# EAGLE design WD1M_RFM9x (EAGLE 7.5.0)
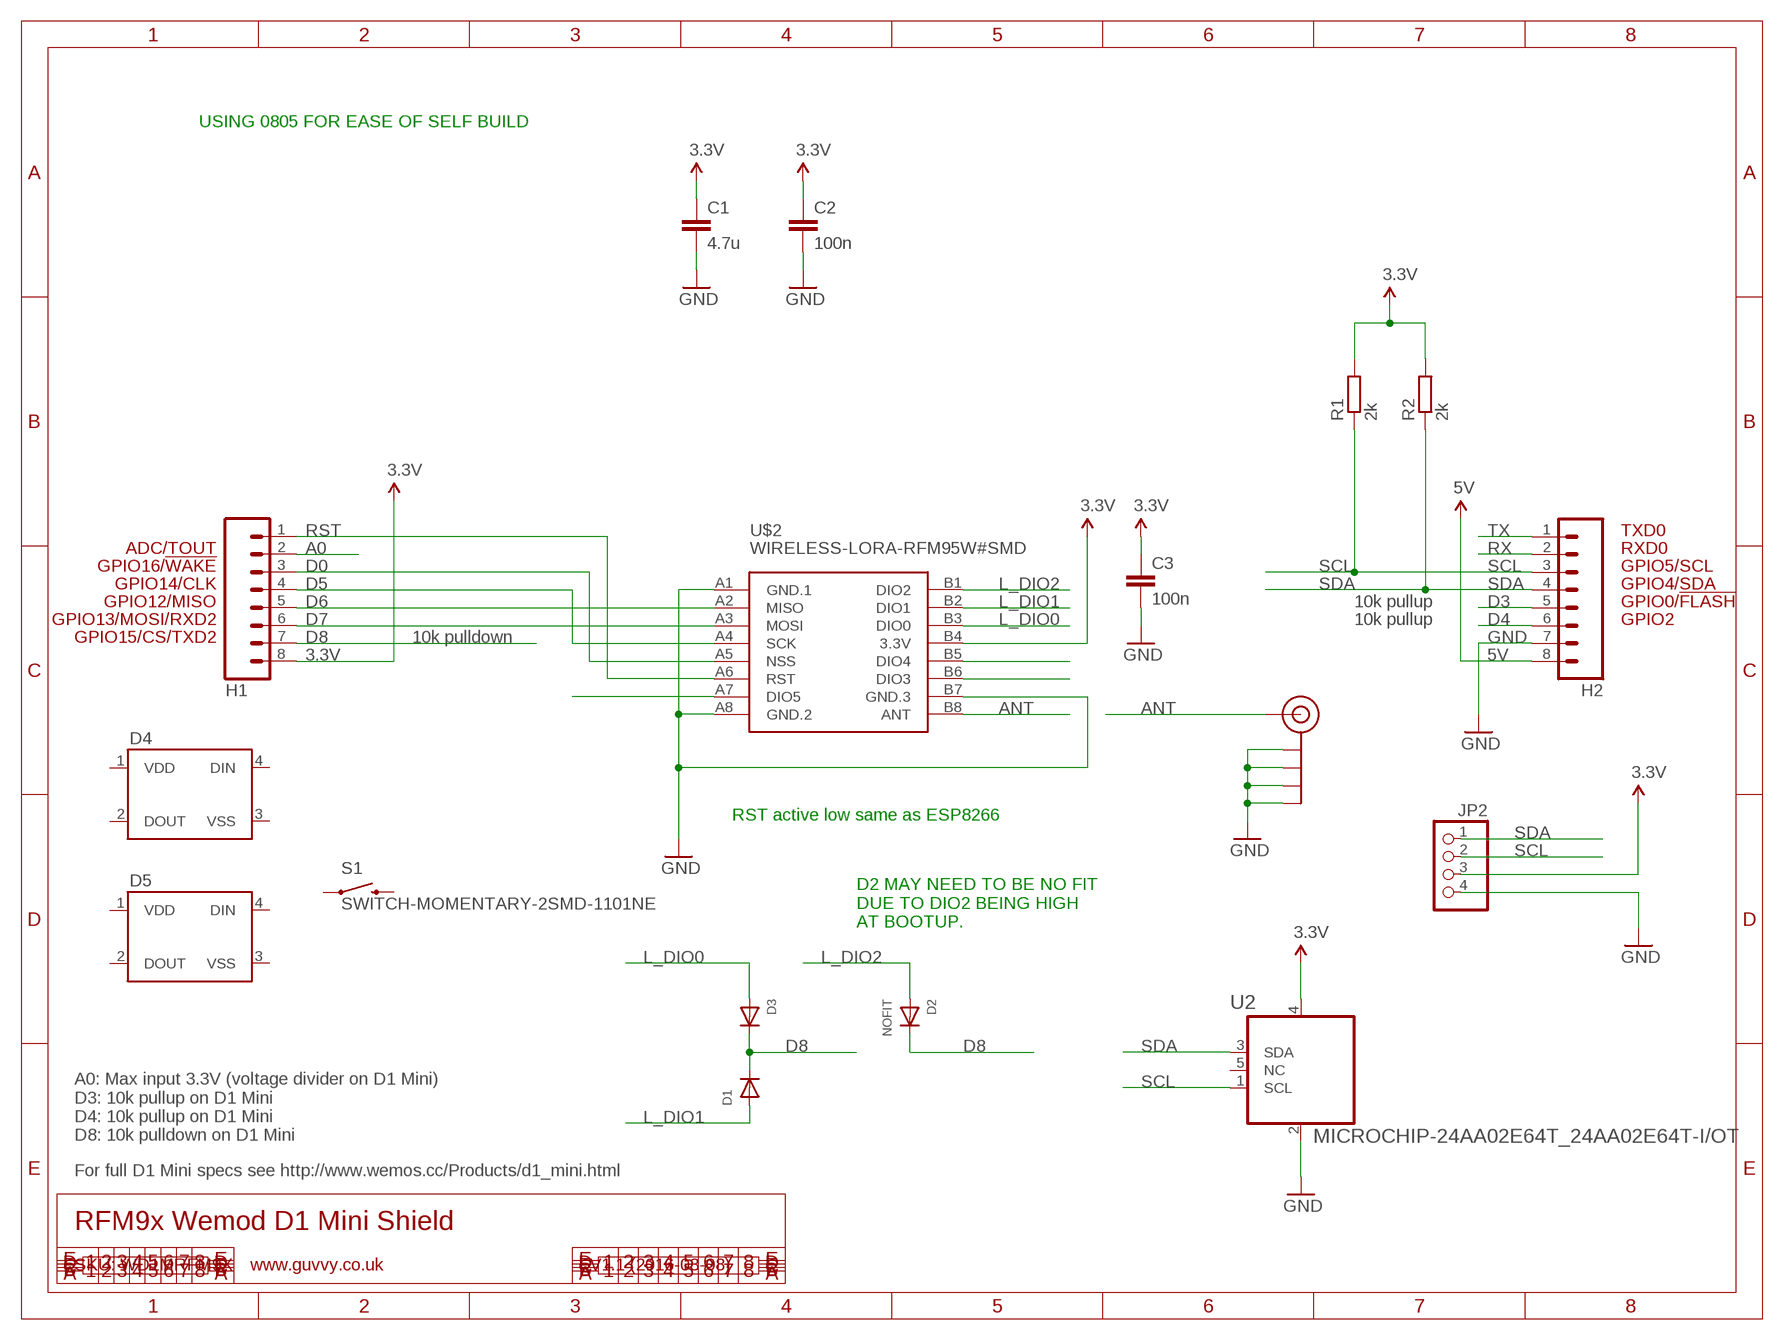
[diagram p0: schematic, sheet 1]

## Parts
C1  4.7u  C-EUC0805K  [C0805K]
C2  100n  C-EUC0805K  [C0805K]
C3  100n  C-EUC0805K  [C0805K]
D1  DIODESOD-323F  [SOD-323F]
D2  NOFIT  DIODESOD-323F  [SOD-323F]
D3  DIODESOD-323F  [SOD-323F]
D4  WS2812B  [WS2812B]
D5  WS2812B  [WS2812B]
H1  M08  [1X08]
H2  M08  [1X08]
J$2  _C2H_ANTENNATINY  [_C2H_SMA_UFL_PAD_TINY]
JP2  PINHD-1X4  [1X04]
R1  2k  R-EU_R0805  [R0805]
R2  2k  R-EU_R0805  [R0805]
S1  SWITCH-MOMENTARY-2SMD-1101NE  [TACTILE-SWITCH-1101NE]
U2  MICROCHIP-24AA02E64T_24AA02E64T-I/OT  [MICROCHIP-24AA02E64T_SOT95P270X145-5N]
U$2  WIRELESS-LORA-RFM95W#SMD  [WIRELESS-LORA-RFM95W#SMD]

## Nets
3.3V: C1.1 C2.1 C3.1 H1.8 JP2.3 R1.2 R2.2 U$2.B4(3.3V)
5V: H2.8
A0: H1.2
ANT: J$2.ANT1(SIGNAL) J$2.ANT2(SIGNAL) J$2.ANT3(SIGNAL) U$2.B8(ANT)
D0: H1.3 U$2.A5(NSS)
D3: H2.5
D4: H2.6
D5: H1.4 U$2.A4(SCK)
D6: H1.5 U$2.A2(MISO)
D7: H1.6 U$2.A3(MOSI)
D8: D1.C D2.C D3.C H1.7
GND: C1.2 C2.2 C3.2 H2.7 J$2.GND1(GND) J$2.GND2(GND) J$2.GND3(GND) J$2.GND4(GND) JP2.4 U2.2(VSS) U$2.A1(GND.1) U$2.A8(GND.2) U$2.B7(GND.3)
L_DIO0: D3.A U$2.B3(DIO0)
L_DIO1: D1.A U$2.B2(DIO1)
L_DIO2: D2.A U$2.B1(DIO2)
L_DIO3: U$2.B6(DIO3)
L_DIO4: U$2.B5(DIO4)
L_DIO5: U$2.A7(DIO5)
RST: H1.1 U$2.A6(RST)
RX: H2.2
SCL: H2.3 JP2.2 R1.1 U2.1(SCL)
SDA: H2.4 JP2.1 R2.1 U2.3(SDA)
TX: H2.1
Unconnected: D4.2(DOUT) D4.4(DIN) D5.2(DOUT) D5.4(DIN) S1.1 S1.2 U2.5(NC)

## Notes on the sheet
- USING 0805 FOR EASE OF SELF BUILD
- TXD0
- ADC/TOUT | RXD0
- GPIO16/!WAKE | GPIO5/SCL
- GPIO14/CLK | GPIO4/SDA
- GPIO12/MISO | 10k pullup | GPIO0/!FLASH
- GPIO13/MOSI/RXD2 | 10k pullup | GPIO2
- GPIO15/CS/TXD2 | 10k pulldown
- RST active low same as ESP8266
- D2 MAY NEED TO BE NO FIT 
  DUE TO DIO2 BEING HIGH 
  AT BOOTUP.
- A0: Max input 3.3V (voltage divider on D1 Mini)
  D3: 10k pullup on D1 Mini
  D4: 10k pullup on D1 Mini
  D8: 10k pulldown on D1 Mini
- For full D1 Mini specs see http://www.wemos.cc/Products/d1_mini.html
- RFM9x Wemod D1 Mini Shield
- SKU: WD1MRFM9X | www.guvvy.co.uk | V1.1 (2016-03-08)

## Power pins joined to a net without a drawn wire
VCC: U2.4(VCC)
VDD: D4.1(VDD) D5.1(VDD)
VSS: D4.3(VSS) D5.3(VSS)

## Library data of the parts
C1-C3 = rcl:C-EU: CAPACITOR, European symbol
D1-D3 = adafruit:DIODE: Diode SMADIODE - SMA Surface Mount Package 20V 1A Schottky Diode Digikey: 641-1014-6-ND DO-1N4148 - Through Hole Small Current Diode SOD-123 20V 1 A (.5mV Vf) Schottky Diode - Digikey: MBRX120TPMSCT-ND SOD-323 10V 570mA (.38mV Vf, 3ns) Schottky Diode - Digikey: ZLLS410CT-ND SOD-523 30V 30mA Schottky Diode (RB751S-40TE61) - Digikey: RB751S-40TE61CT-ND SOT23-R/W - SOT23 Package (R = Solder Paste/Reflow Ovens, W = Hand-Soldering) BAT54Film 40V 300mA - Digikey: 497-7162-1-ND
D4 D5 = SparkFun-LED:WS2812B: WS2812B - Intelligent control LED integrated light source Technical Specifications: Power Supply Voltage (VDD): 3.5 to 5.3 V Input Voltage (VI): -0.5 to VDD+0.5 V Operating Junction Temperature (Topt): -25°C to +80°C Storage Temperature Range (Tstg): -55°C to +150°C
H1 H2 = freetronics-original:M08: Header 8 Standard 8-pin 0.1" header. Use with straight break away headers (SKU : PRT-00116), right angle break away headers (PRT-00553), swiss pins (PRT-00743), machine pins (PRT-00117), and female headers (PRT-00115).
J$2 = WeMos-Lora:_C2H_ANTENNA: SMA Antenna Connector End launch SMA connector. The paste layer has been removed so that the connector can be hand soldered onto the board after reflow.
JP2 = pinhead:PINHD-1X4: PIN HEADER
R1 R2 = rcl:R-EU_: RESISTOR, European symbol
S1 = SparkFun-Electromechanical:SWITCH-MOMENTARY-2: Various NO switches- pushbuttons, reed, etc; PROD_ID: SWCH-00815
U2 = WeMos-Lora:MICROCHIP-24AA02E64T_24AA02E64T-I/OT: 2K I2C™ Serial EEPROMs, SOT23-5; MPN: 24AA02E64T-I/OT; OC_FARNELL: 2345567; OC_NEWARK: 01X0461; PACKAGE: SOT23-5; SUPPLIER: Microchip
U$2 = diy-modules:WIRELESS-LORA-RFM95W: 868/915 MHz LoRa Radio Transceiver Module based on SX1276 chip Click here to find device on ebay.com <http://www.ebay.com/sch/RFM95W+transceiver>

## Net classes
0 default: width 0.203 mm, drill 0.356 mm, clearance 0.152 mm
1 power: width 0.203 mm, clearance 0.152 mm

## Board
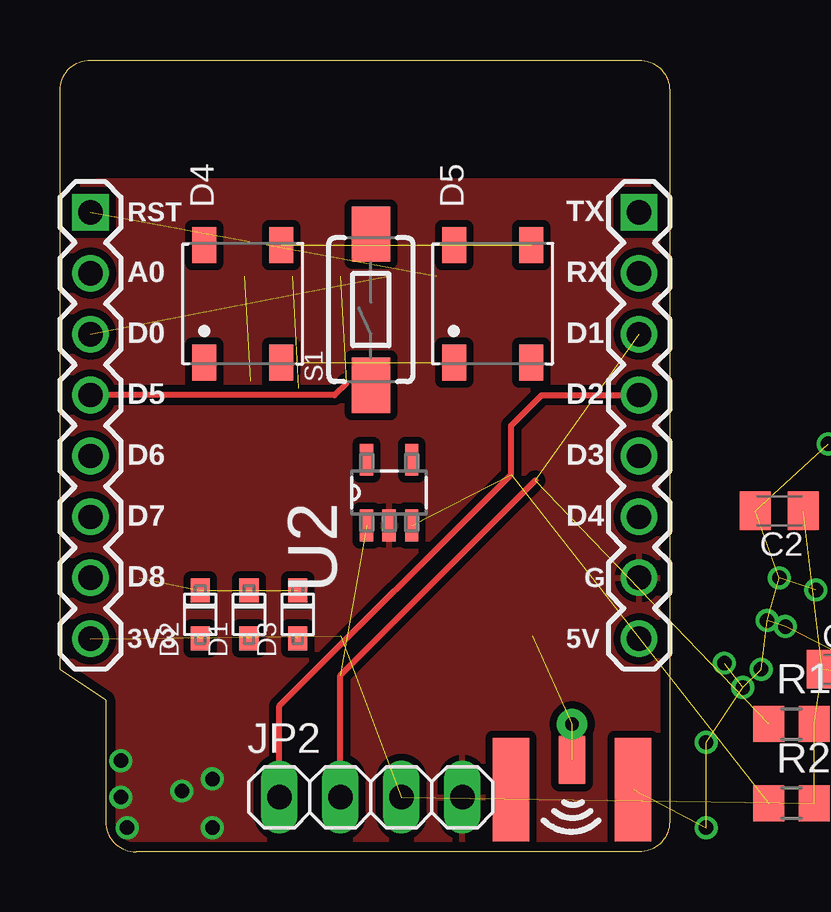
[diagram p1: board, top side]
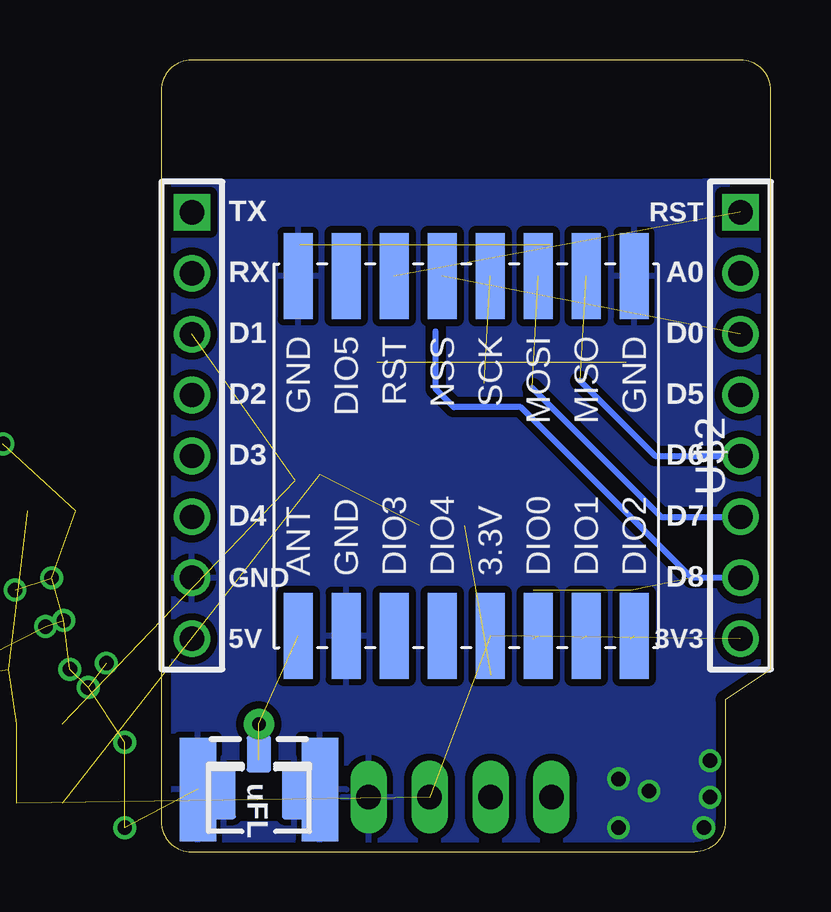
[diagram p2: board, bottom side, seen from below]

Size 25.4 x 33.02 mm. Coordinates in mm from the lower left corner, seen from the top.
Outline: 25.4,31.75 25.4,1.27 arc-90 24.13,0 3.17,0 arc-90 1.91,1.27 1.91,6.35 0,7.62 0,31.75 arc-90 1.27,33.02 24.13,33.02 arc-90 25.4,31.75
Copper layers (1*16): Top 0.0356mm / dielectric 1.5011mm / Bottom 0.0356mm
Design rules "oshpark-2layer": minimum track width 6mil, minimum drill 13mil, track to track 6mil, track to pad 6mil, pad to pad 6mil, via to via 6mil, smd to smd 6mil, copper to edge 15mil, drill to drill 6mil, minimum pad ring 7mil, minimum via ring 7mil, stop-mask expansion 2.5mil, vias tented up to drill 0mil, thermal gap 10mil

### Footprints (pad centres in the part's own frame; a part is rotated, then mirrored left to right if it is on the bottom)
C0805K = smd 1.3 x 1.6: 1 -1,0; 2 1,0
SOD-323F = smd 1 x 0.8: A -1,0; C 1,0
WS2812B = smd 1.5 x 1: 1 -2.45,1.6; 2 -2.45,-1.6; 3 2.45,-1.6; 4 2.45,1.6
1X08 = drill 1.016 square: 1 0,0 | drill 1.016: 2 2.54,0; 3 5.08,0; 4 7.62,0; 5 10.16,0; 6 12.7,0; 7 15.24,0; 8 17.78,0
_C2H_SMA_UFL_PAD_TINY = smd 1.524 x 1.016: ANT1 -3.843,0 | drill 0.559 pad 1.27: ANT2 -5.08,0 | smd 2.032 x 1.143 bottom: ANT3 -3.589,0 | smd 2.2 x 1.016: GND1 -2.223,1.47; GND2 -2.223,-1.47 | smd 4.318 x 1.524: GND3 -2.349,-2.54; GND4 -2.349,2.54 | smd 4.318 x 1.524 bottom: GND5 -2.349,2.54; GND6 -2.349,-2.54
1X04 = drill 1.016 long: 1 -3.81,0; 2 -1.27,0; 3 1.27,0; 4 3.81,0
R0805 = smd 1.3 x 1.5: 1 -0.95,0; 2 0.95,0
TACTILE-SWITCH-1101NE = smd 2.3 x 1.6: 1 -3.15,0; 2 3.15,0
MICROCHIP-24AA02E64T_SOT95P270X145-5N = smd 1.321 x 0.559: 1 -1.372,0.94; 2 -1.372,0; 3 -1.372,-0.94; 4 1.372,-0.94; 5 1.372,0.94
WIRELESS-LORA-RFM95W#SMD = smd 3.6 x 1.2: A1 -7.5,7; A2 -7.5,5; A3 -7.5,3; A4 -7.5,1; A5 -7.5,-1; A6 -7.5,-3; A7 -7.5,-5; A8 -7.5,-7; B1 7.5,7; B2 7.5,5; B3 7.5,3; B4 7.5,1; B5 7.5,-1; B6 7.5,-3; B7 7.5,-5; B8 7.5,-7

### Placement (x,y rotation side)
C1  32.77,7.62 0 top  (outside the outline)
C2  29.97,14.22 180 top  (outside the outline)
C3  37.34,6.6 180 top  (outside the outline)
D1  7.87,9.91 90 top
D2  5.84,9.91 90 top
D3  9.91,9.91 90 top
D4  7.62,22.86 90 top
D5  18.03,22.86 90 top
H1  1.27,26.67 270 top
H2  24.13,26.67 270 top
J$2  21.34,0.25 270 bottom
JP2  12.95,2.29 0 top
R1  30.48,5.33 0 top  (outside the outline)
R2  30.48,2.03 0 top  (outside the outline)
S1  12.95,22.61 90 top
U2  13.72,14.99 90 top
U$2  12.7,16.51 270 bottom

### Tracks (layer width: path | path; a pad name or v marks a point on that pad's centre or on a via)
3.3V  (7 unrouted)
ANT  (3 unrouted)
D0  (1 unrouted)
D5  (1 unrouted)
  Top 0.254: 11.94,19.56 11.43,19.05 H1.4
D6  (1 unrouted)
  Bottom 0.254: 7.95,19.64 4.83,16.51 H1.5
D7  (1 unrouted)
  Bottom 0.254: 9.95,19.35 4.57,13.97 H1.6
D8  (3 unrouted)
  Bottom 0.254: H1.7 3.3,11.43 10.41,18.54 13.21,18.54 13.97,19.3 13.97,21.71
GND  (via drill 0.6)  (13 unrouted)
  other vias: 28.45,6.86 5.08,2.54 2.54,3.81 32,17.02 29.97,11.43 31.5,10.92 27.69,7.87 29.21,7.62 29.46,9.65 2.54,2.29 6.35,1.02 26.92,4.57 30.23,9.4 2.79,1.02 6.35,3.05 26.92,1.02
  pour Top (isolate 0.305): 25.4,26.16 arc90 24.13,27.94 1.52,27.94 arc90 0,26.42 0,7.62 1.91,6.35 1.91,1.27 arc90 3.17,0 24.13,0 arc90 25.4,1.27
  pour Bottom (isolate 0.305): 25.4,1.27 25.4,26.92 arc90 24.64,27.94 3.05,27.94 arc90 0,25.65 0,7.62 1.91,6.35 1.91,1.27 arc90 3.17,0 24.13,0 arc90
L_DIO0  (1 unrouted)
L_DIO1  (1 unrouted)
L_DIO2  (1 unrouted)
RST  (1 unrouted)
SCL  (3 unrouted)
  Top 0.254: JP2.2 11.68,7.37 19.81,15.49
SDA  (2 unrouted)
  Top 0.254: JP2.1 9.14,6.1 18.8,15.75 18.8,17.78 20.07,19.05 H2.4
VDD  (1 unrouted)
VSS  (1 unrouted)

### Text on the board
tPlace: RST | TX | A0 | RX | D0 | D1 | D5 | D2 | D6 | D3 | D7 | D4 | D8 | G | 3V3 | 5V
bPlace: RST | TX | A0 | RX | D0 | D1 | D5 | D2 | D6 | D3 | D7 | D4 | D8 | GND | 3V3 | 5V